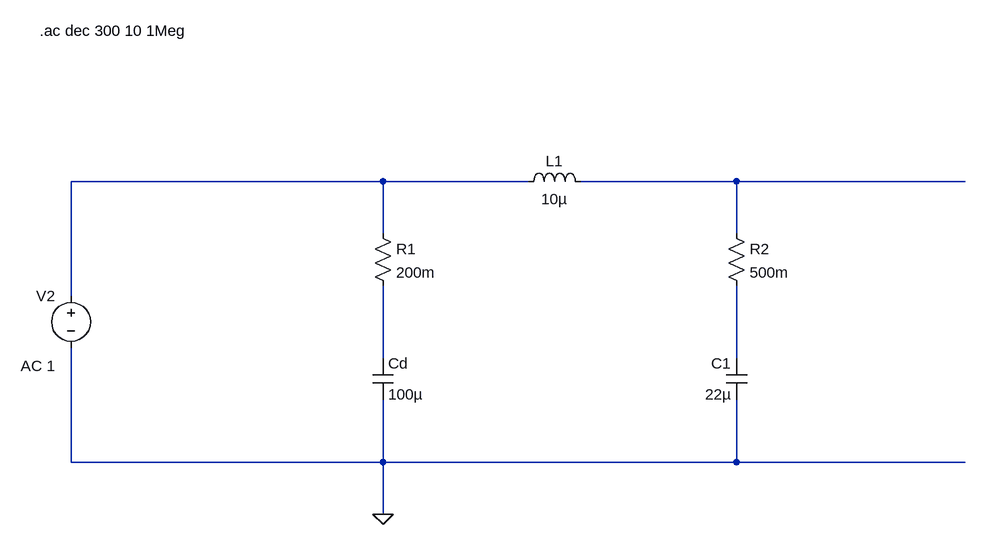
[diagram p0: schematic emi_filter.asc]
emi_filter.asc, the LTspice schematic file:
Version 4
SHEET 1 1712 724
WIRE 736 192 256 192
WIRE 960 192 736 192
WIRE 1280 192 1040 192
WIRE 1632 192 1280 192
WIRE 736 272 736 192
WIRE 1280 272 1280 192
WIRE 256 368 256 192
WIRE 736 464 736 352
WIRE 1280 464 1280 352
WIRE 256 624 256 448
WIRE 736 624 736 528
WIRE 736 624 256 624
WIRE 1280 624 1280 528
WIRE 1280 624 736 624
WIRE 1632 624 1280 624
WIRE 736 704 736 624
FLAG 736 704 0
SYMBOL cap 1296 464 M0
SYMATTR InstName C1
SYMATTR Value 22µ
SYMATTR SpiceLine Rser=100m
SYMBOL ind 1056 208 M270
WINDOW 0 32 56 VTop 2
WINDOW 3 5 56 VBottom 2
SYMATTR InstName L1
SYMATTR Value 10µ
SYMATTR SpiceLine Rser=50m
SYMBOL voltage 256 352 M0
WINDOW 123 24 124 Left 2
WINDOW 39 0 0 Left 0
SYMATTR Value2 AC 1
SYMATTR InstName V2
SYMATTR Value ""
SYMBOL cap 720 464 R0
SYMATTR InstName Cd
SYMATTR Value 100µ
SYMATTR SpiceLine Rser=45m
SYMBOL res 720 256 R0
SYMATTR InstName R1
SYMATTR Value 200m
SYMBOL res 1264 256 R0
SYMATTR InstName R2
SYMATTR Value 500m
TEXT 208 -40 Left 2 !.ac dec 300 10 1Meg

The netlist it stands for:
* emi_filter.asc
C1 N004 0 22µ Rser=100m
L1 N002 N001 10µ Rser=50m
V2 N001 0 AC 1
Cd N003 0 100µ Rser=45m
R1 N001 N003 200m
R2 N002 N004 500m
.ac dec 300 10 1Meg
.backanno
.end